# Altium project AirSensor.PrjPcb
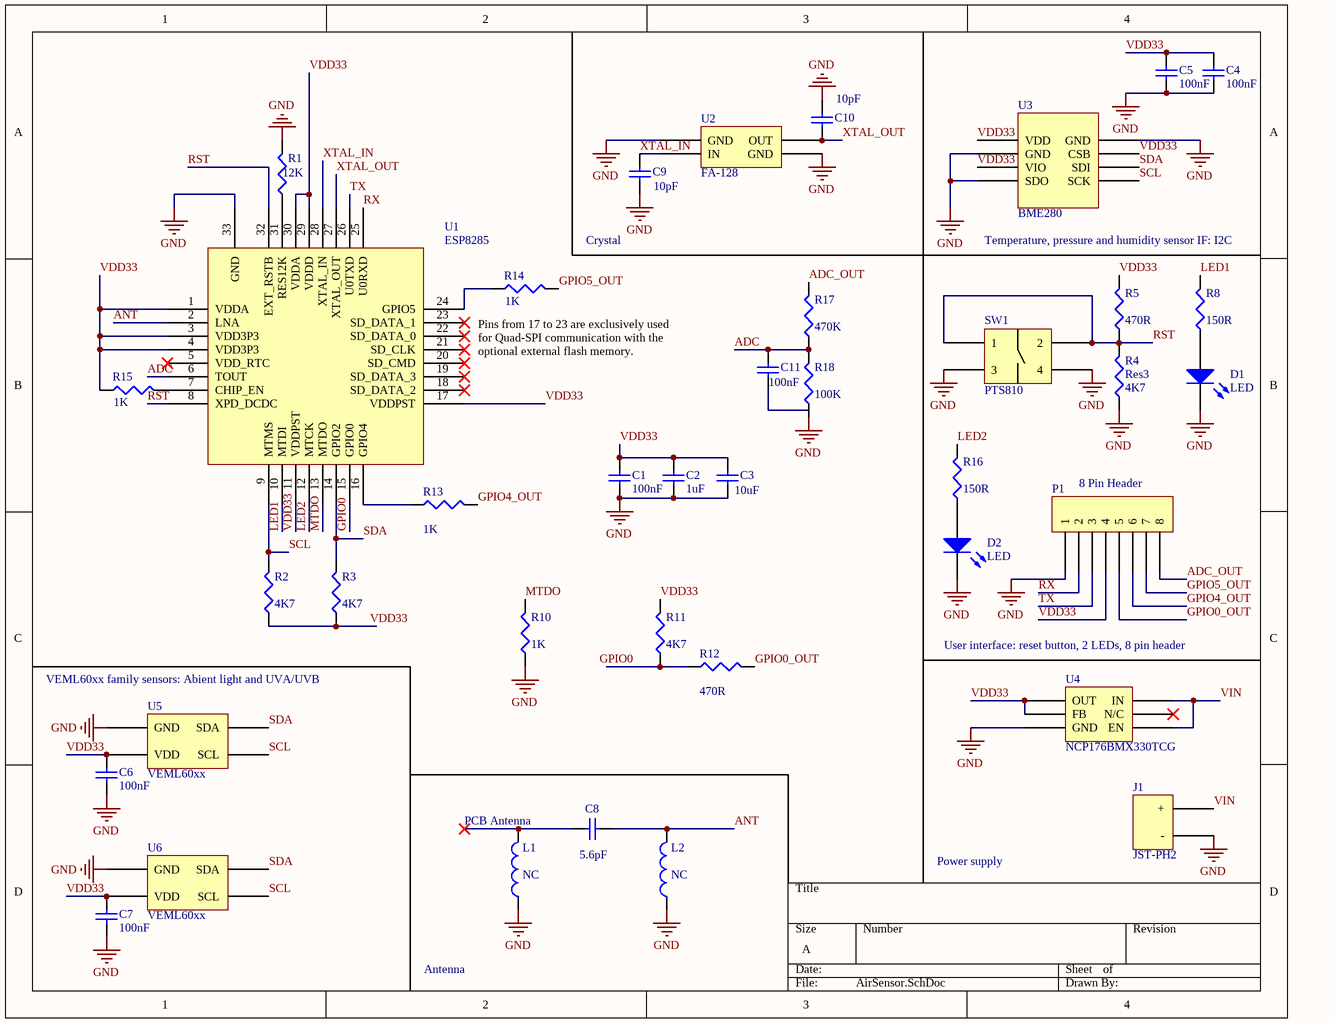
[diagram p0: AirSensor.SchDoc]
1 sheet, 39 parts. Net scope: global (net labels, ports and power ports of the same name join across sheets).
Board file: AirSensor.PcbDoc

## Sheet AirSensor.SchDoc
size A

### Parts
C1  value 100nF  [1608[0603]]
C2  value 1uF  [1608[0603]]  (hidden comment: Cap Semi)
C3  value 10uF  [1608[0603]]  (hidden comment: Cap Semi)
C4  value 100nF  [1608[0603]]
C5  value 100nF  [1608[0603]]
C6  value 100nF  [1608[0603]]
C7  value 100nF  [1608[0603]]
C8  value 5.6pF  [1608[0603]]  (hidden comment: Cap Semi)
C9  value 10pF  [1608[0603]]  (hidden comment: Cap Semi)
C10  value 10pF  [1608[0603]]  (hidden comment: Cap Semi)
C11  value 100nF  [1608[0603]]  (hidden comment: Cap Semi)
D1  LED  [LED0603]
D2  LED  [LED0603]
J1  JST-PH2  [JST-PH2]
L1  value NC  [2029]  (hidden comment: Inductor)
L2  value NC  [2029]  (hidden comment: Inductor)
P1  8 Pin Header  [Header8]
R1  value 12K  [J1-0603]
R2  value 4K7  [J1-0603]  (hidden comment: Res3)
R3  value 4K7  [J1-0603]  (hidden comment: Res3)
R4  Res3  value 4K7  [J1-0603]
R5  value 470R  [J1-0603]  (hidden comment: Res3)
R8  value 150R  [J1-0603]  (hidden comment: Res3)
R10  value 1K  [J1-0603]  (hidden comment: Res3)
R11  value 4K7  [J1-0603]  (hidden comment: Res3)
R12  value 470R  [J1-0603]  (hidden comment: Res3)
R13  value 1K  [J1-0603]  (hidden comment: Res3)
R14  value 1K  [J1-0603]  (hidden comment: Res3)
R15  value 1K  [J1-0603]  (hidden comment: Res3)
R16  value 150R  [J1-0603]  (hidden comment: Res3)
R17  value 470K  [J1-0603]  (hidden comment: Res3)
R18  value 100K  [J1-0603]  (hidden comment: Res3)
SW1  PTS810  [PTS810]
U1  ESP8285  [QFN50P500X500X80_HS-33N]
U2  FA-128  [DFN95P200X50-4N]
U3  BME280  [BME280]
U4  NCP176BMX330TCG  [NCP176BMX330TCG]
U5  VEML60xx  [VEML60xx]
U6  VEML60xx  [VEML60xx]

### Nets
GND: C1.1 C2.1 C3.2 C4.1 C5.1 C6.1 C7.1 C9.1 C10.2 D1.2(K) D2.2(K) J1.1(-) L1.1 L2.1 P1.1 R1.2 R4.1 R10.1 R18.1 SW1.3 SW1.4 U1.33(GND) U2.2(GND) U2.4(GND) U3.1(GND) U3.5(SDO) U3.7(GND) U4.3(GND) U5.1(GND) U6.1(GND)
ADC: C11.2 R17.1 R18.2 U1.6(TOUT)
ADC_OUT: P1.8 R17.2
ANT: C8.2 L2.2 U1.2(LNA)
GPIO0: U1.15(GPIO0)
GPIO0_OUT: P1.5 R12.2
GPIO4_OUT: P1.6 R13.2
GPIO5_OUT: P1.7 R14.2
LED1: R8.2 U1.10(MTDI)
LED2: R16.2 U1.12(MTCK)
MTDO: R10.2 U1.13(MTDO)
RST: R4.2 R5.1 SW1.1 SW1.2 U1.8(XPD_DCDC) U1.32(EXT_RSTB)
RX: P1.2 U1.25(U0RXD)
SCL: R2.2 U1.9(MTMS) U3.4(SCK) U5.3(SCL) U6.3(SCL)
SDA: R3.2 U1.14(GPIO2) U3.3(SDI) U5.2(SDA) U6.2(SDA)
TX: P1.3 U1.26(U0TXD)
VDD33: C1.2 C2.2 C3.1 C4.2 C5.2 C6.2 C7.2 P1.4 R2.1 R3.1 R5.2 R11.2 R15.1 U1.1(VDDA) U1.3(VDD3P3) U1.4(VDD3P3) U1.11(VDDPST) U1.17(VDDPST) U1.29(VDDD) U1.30(VDDA) U3.2(CSB) U3.6(VIO) U3.8(VDD) U4.1(OUT) U4.2(FB) U5.4(VDD) U6.4(VDD)
VIN: J1.2(+) U4.4(EN) U4.6(IN)
XTAL_IN: C9.2 U1.28(XTAL_IN) U2.1(IN)
XTAL_OUT: C10.1 U1.27(XTAL_OUT) U2.3(OUT)
NetC8_1: C8.1 L1.2
NetD1_1: D1.1(A) R8.1
NetD2_1: D2.1(A) R16.1
NetR1_1: R1.1 U1.31(RES12K)
NetR11_1: R11.1 R12.1
NetR13_1: R13.1 U1.16(GPIO4)
NetR14_1: R14.1 U1.24(GPIO5)
NetR15_2: R15.2 U1.7(CHIP_EN)

Not connected (* = marked no-connect by the designer): C11 1; U1 5(VDD_RTC)* 18(SD_DATA_2)* 19(SD_DATA_3)* 20(SD_CMD)* 21(SD_CLK)* 22(SD_DATA_0)* 23(SD_DATA_1)*; U4 5(N/C)*

### Notes on the sheet
- Crystal
- Temperature, pressure and humidity sensor IF: I2C
- (near R14) Pins from 17 to 23 are exclusively used for Quad-SPI communication with the optional external flash memory.
- VEML60xx family sensors: Abient light and UVA/UVB
- (near U4) User interface: reset button, 2 LEDs, 8 pin header
- (near L1) PCB Antenna
- Power supply
- Antenna
- Labels drawn without touching a wire or pin: GPIO0

### Library data of the parts
C1-C11 = Cap Semi: Capacitor (Semiconductor SIM Model); Published: 8-Jun-2000; LatestRevisionDate: 29-May-2009; LatestRevisionNote: IPC-7351 Footprint Added.; PackageReference: C1206; Publisher: Altium Limited; PackageDescription: Chip Capacitor
D1 D2 = LED3: Typical BLUE SiC LED; Published: 8-Jun-2000; LatestRevisionDate: 17-Dec-2003; LatestRevisionNote: PCB Footprint replaced.; DatasheetVersion: 16-Apr-2002; PackageVersion: 16-Apr-2002; PackageReference: 3.5X2.8X1.9; Publisher: Altium Limited; PackageDescription: SM LED; 2 C-Bend Leads; Body 3.5 x 2.8 x 1.9 mm, inc leads (LxWxH typ)
L1 L2 = Inductor: Code_IEC: 1005; Published: 8-Jun-2000; LatestRevisionDate: 29-May-2009; LatestRevisionNote: IPC-7351 Footprint Added.; PackageReference: 0402-A; Publisher: Altium Limited; PackageDescription: Chip Inductor; Code_JEITA: 0402
P1 = Header8
R1-R5 R8 R10-R18 = Res3: Resistor; Published: 8-Jun-2000; LatestRevisionDate: 29-May-2009; LatestRevisionNote: IPC-7351 Footprint Added.; PackageReference: J1-0603; Publisher: Altium Limited; PackageDescription: Chip Resistor
U1 = ESP8285: ESP8285 Wifi enabled microcontroller
U2 = FA128: FA-128 26.0000MF10Z-W3
U3 = BME280: BME280 Temp., hum., press. sensor